# EAGLE design RH047.2 (EAGLE 7.7.0)
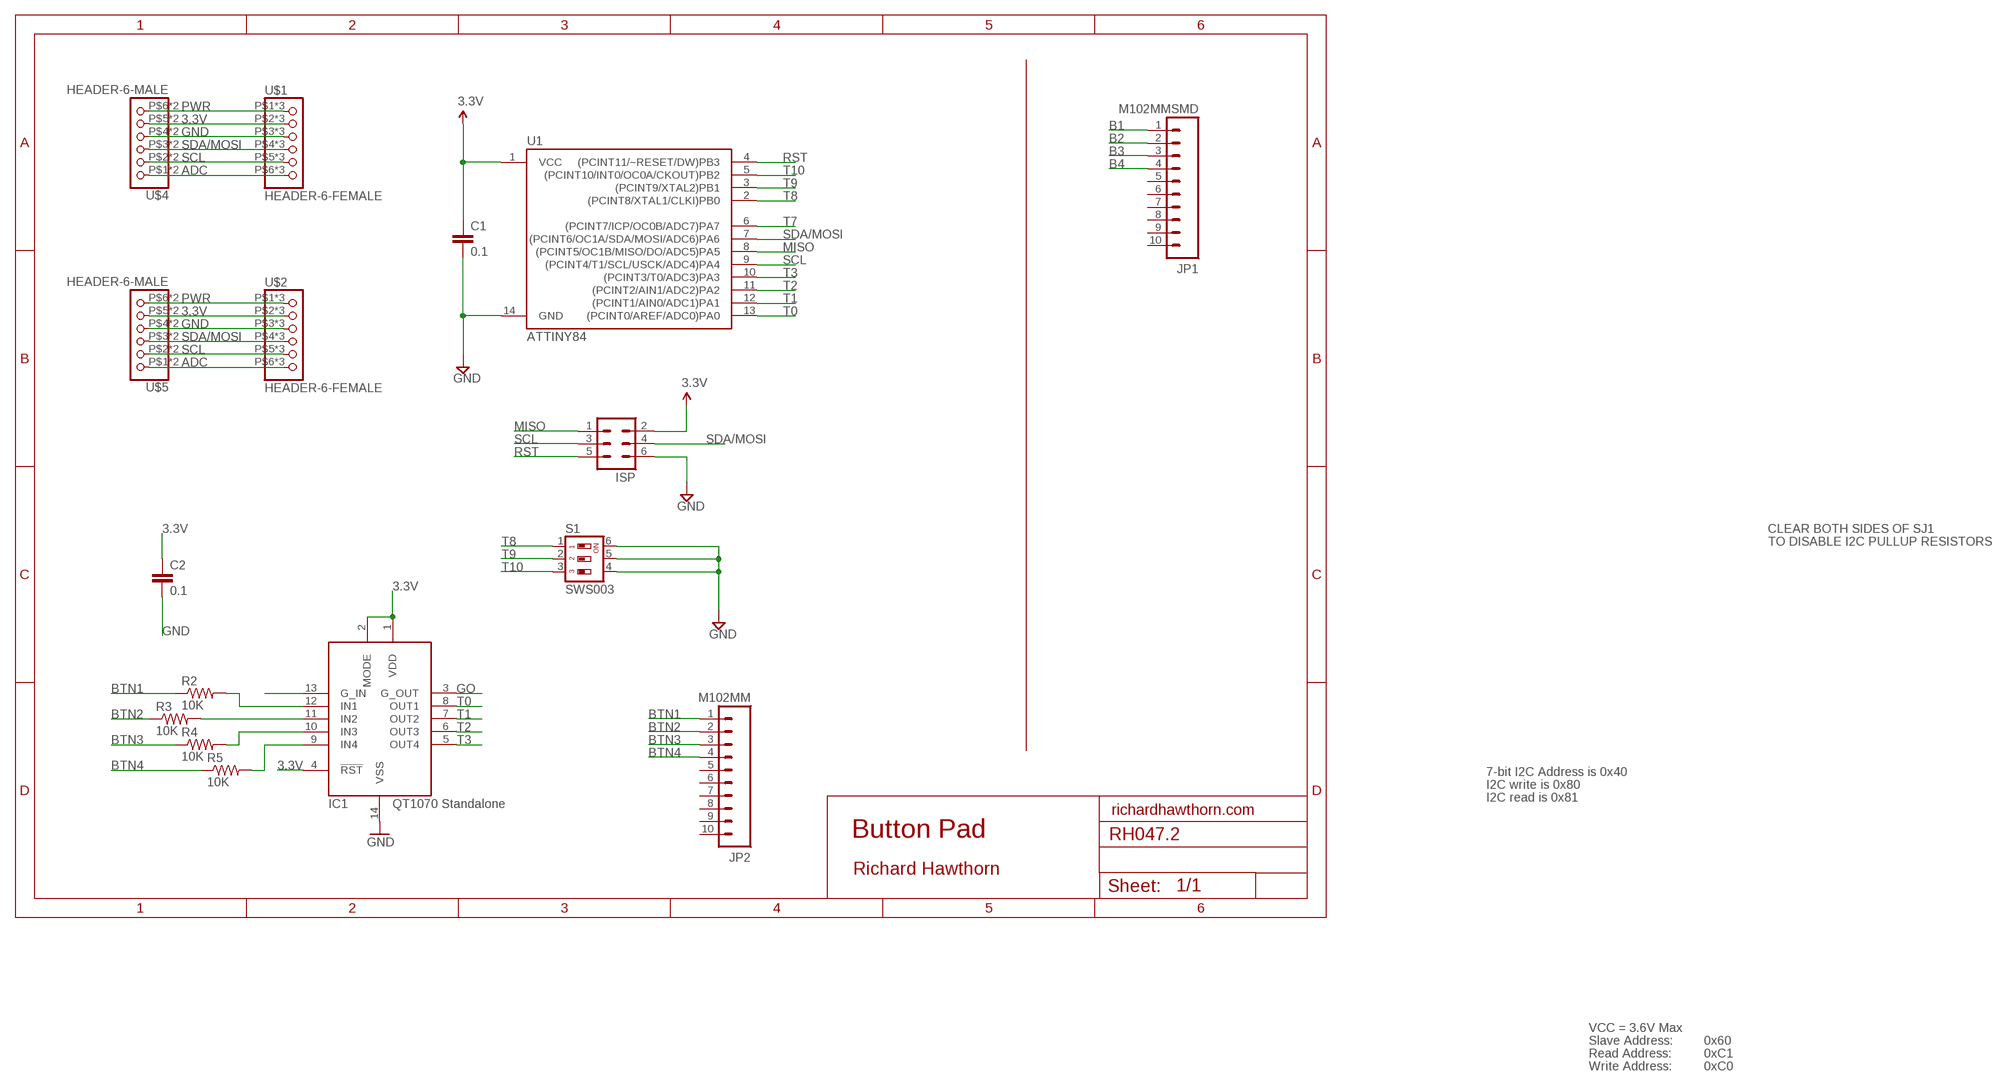
[diagram p0: schematic, sheet 1]

## Parts
C1  0.1  CAP0603-CAP  [0603-CAP]
C2  0.1  CAP0603-CAP  [0603-CAP]
IC1  AT42QT1070-SSU  [SO14]
ISP  MA03-2  [MA03-2]
JP1  M102MMSMD  [1X10-2MM-SMD]
JP2  M102MM  [1X10-2MM]
R2  10K  R-US_R0805  [R0805]
R3  10K  R-US_R0805  [R0805]
R4  10K  R-US_R0805  [R0805]
R5  10K  R-US_R0805  [R0805]
S1  SWS003  [SMS-003]
U1  ATTINY84  [SO14]
U$1  HEADER-6-FEMALE  [2MMHEADER6]
U$2  HEADER-6-FEMALE  [2MMHEADER6]
U$4  HEADER-6-MALE  [2MMHEADERPIN6]
U$5  HEADER-6-MALE  [2MMHEADERPIN6]

## Nets
3.3V: C1.1 C2.1 IC1.1(VDD) IC1.2(MODE) IC1.4(!RST) ISP.2 U1.1(VCC) U$1.P$2 U$1.P$10 U$1.P$18 U$2.P$2 U$2.P$10 U$2.P$18 U$4.P$5 U$4.P$13 U$5.P$5 U$5.P$13
ADC: U$1.P$6 U$1.P$14 U$1.P$22 U$2.P$6 U$2.P$14 U$2.P$22 U$4.P$1 U$4.P$9 U$5.P$1 U$5.P$9
B1: JP1.1
B2: JP1.2
B3: JP1.3
B4: JP1.4
BTN1: JP2.1 R2.1
BTN2: JP2.2 R3.1
BTN3: JP2.3 R4.1
BTN4: JP2.4 R5.1
GND [power]: C1.2 C2.2 IC1.14(VSS) ISP.6 S1.4 S1.5 S1.6 U1.14(GND) U$1.P$3 U$1.P$11 U$1.P$19 U$2.P$3 U$2.P$11 U$2.P$19 U$4.P$4 U$4.P$12 U$5.P$4 U$5.P$12
GO: IC1.3(G_OUT)
MISO: ISP.1 U1.8((PCINT5/OC1B/MISO/DO/ADC5)PA5)
N$1: IC1.13(G_IN)
N$2: IC1.12(IN1) R2.2
N$3: IC1.11(IN2) R3.2
N$4: IC1.10(IN3) R4.2
N$9: IC1.9(IN4) R5.2
PWR [power]: U$1.P$1 U$1.P$9 U$1.P$17 U$2.P$1 U$2.P$9 U$2.P$17 U$4.P$6 U$4.P$14 U$5.P$6 U$5.P$14
RST: ISP.5 U1.4((PCINT11/~RESET/DW)PB3)
SCL: ISP.3 U1.9((PCINT4/T1/SCL/USCK/ADC4)PA4) U$1.P$5 U$1.P$13 U$1.P$21 U$2.P$5 U$2.P$13 U$2.P$21 U$4.P$2 U$4.P$10 U$5.P$2 U$5.P$10
SDA/MOSI: ISP.4 U1.7((PCINT6/OC1A/SDA/MOSI/ADC6)PA6) U$1.P$4 U$1.P$12 U$1.P$20 U$2.P$4 U$2.P$12 U$2.P$20 U$4.P$3 U$4.P$11 U$5.P$3 U$5.P$11
T0: IC1.8(OUT1) U1.13((PCINT0/AREF/ADC0)PA0)
T1: IC1.7(OUT2) U1.12((PCINT1/AIN0/ADC1)PA1)
T2: IC1.6(OUT3) U1.11((PCINT2/AIN1/ADC2)PA2)
T3: IC1.5(OUT4) U1.10((PCINT3/T0/ADC3)PA3)
T7: U1.6((PCINT7/ICP/OC0B/ADC7)PA7)
T8: S1.1 U1.2((PCINT8/XTAL1/CLKI)PB0)
T9: S1.2 U1.3((PCINT9/XTAL2)PB1)
T10: S1.3 U1.5((PCINT10/INT0/OC0A/CKOUT)PB2)
Unconnected: JP1.5 JP1.6 JP1.7 JP1.8 JP1.9 JP1.10 JP2.5 JP2.6 JP2.7 JP2.8 JP2.9 JP2.10

## Notes on the sheet
- CLEAR BOTH SIDES OF SJ1
- TO DISABLE I2C PULLUP RESISTORS
- 7-bit I2C Address is 0x40
- I2C write is 0x80
- I2C read is 0x81
- richardhawthorn.com
- Button Pad
- Richard Hawthorn
- VCC = 3.6V Max
- Slave Address: | 0x60
- Read Address: | 0xC1
- Write Address: | 0xC0

## Library data of the parts
C1 C2 = LowPowerLab:CAP: Capacitor Standard 0603 ceramic capacitor, and 0.1" leaded capacitor.
IC1 = adafruit:AT42QT1070: QTouch 5-channel standalone sensor IC AT42QT1070 in standalone mode has 5 inputs (guard + 4 key) and open drain outputs. 1.8V-5.5V power.
ISP = Richards:MA03-2: PIN HEADER; OC_FARNELL: unknown; OC_NEWARK: unknown
JP1 JP2 = SparkFun-Connectors:M10: Header 10 Standard 10-pin 0.1" header. Use with straight break away headers (SKU : PRT-00116), right angle break away headers (PRT-00553), swiss pins (PRT-00743), machine pins (PRT-00117), and female headers (PRT-00115).
R2-R5 = rcl:R-US_: RESISTOR, American symbol
S1 = smd-special:SWS003: SMD Dip Switch 3 pol.
U1 = SparkFun-DigitalIC:ATTINY84: Atmel 14-pin 2/4/8kB flash uC
U$1 U$2 = Richards:HEADER-6-FEMALE
U$4 U$5 = Richards:HEADER-6-MALE

## Net classes
1 power: width 0.381 mm, clearance 0.254 mm

## Board
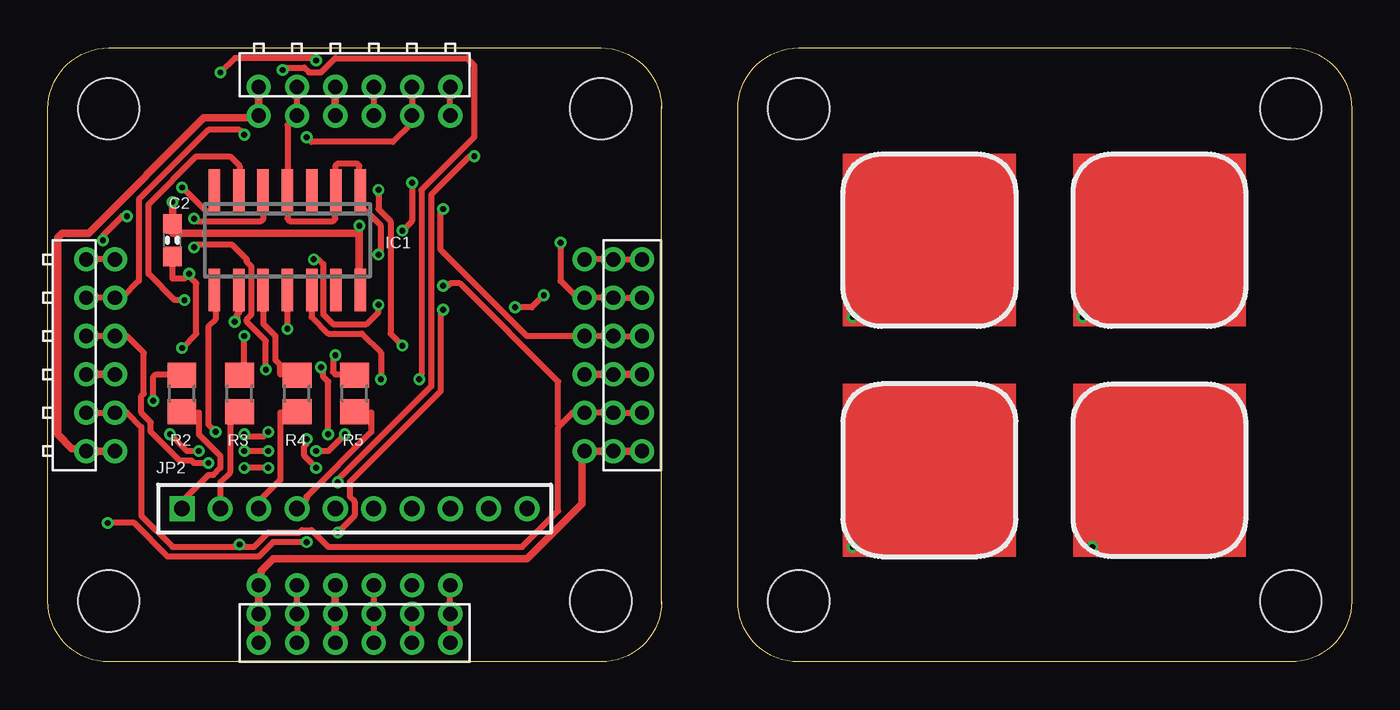
[diagram p1: board, top side]
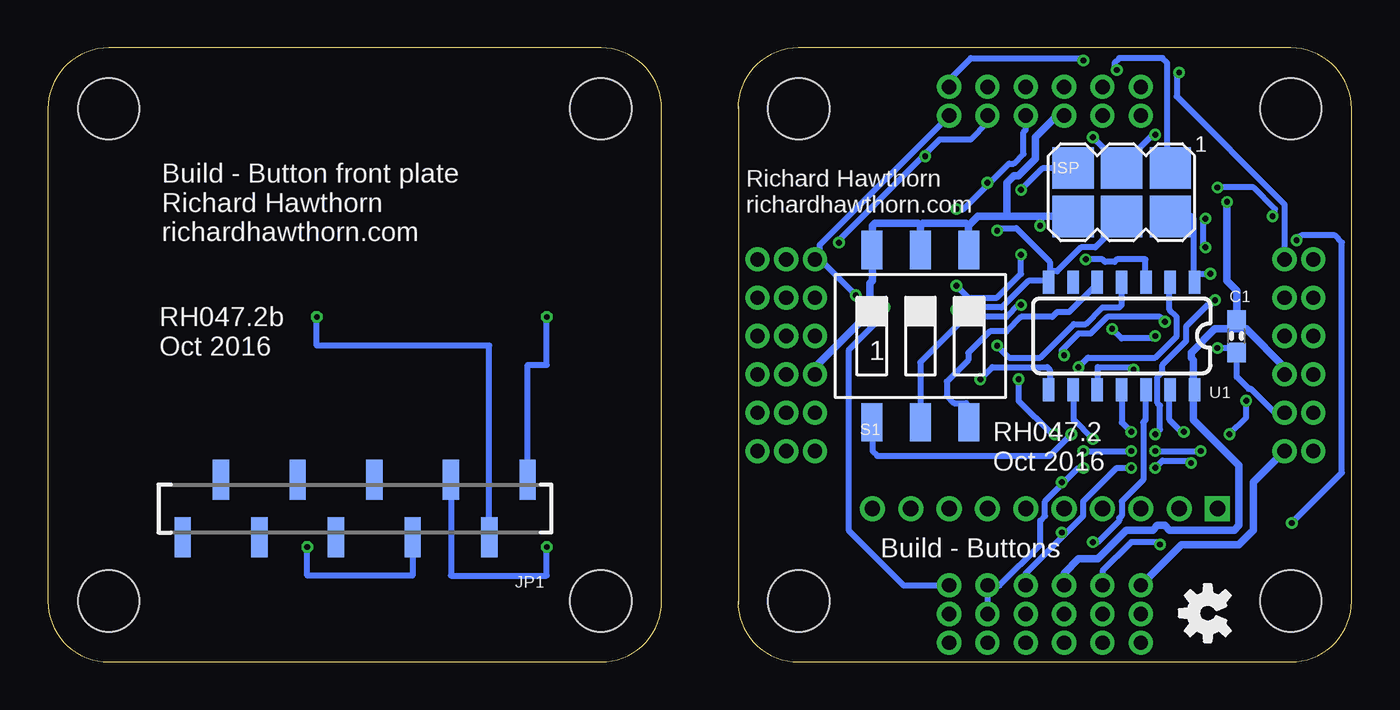
[diagram p2: board, bottom side, seen from below]

Size 68.03 x 32.03 mm. Coordinates in mm from the lower left corner, seen from the top.
Outline: 32.03,28.86 arc90 28.86,32.03 3.17,32.03 arc90 0,28.86 0,3.17 arc90 3.17,0 28.86,0 arc90 32.03,3.17
Outline: 32,25 32,9
Outline: 32,29 32,3
Outline: 36,28.86 arc-90 39.17,32.03 64.86,32.03 arc-90 68.03,28.86 68.03,3.17 arc-90 64.86,0 39.17,0 arc-90 36,3.17 36,28.86
Copper layers (1*16): Top 0.035mm / dielectric 1.5mm / Bottom 0.035mm
Design rules "ITEADstudio_DRC *": minimum track width 12mil, minimum drill 12mil, track to track 6mil, track to pad 6mil, pad to pad 6mil, via to via 6mil, smd to smd 0mil, copper to edge 10mil, drill to drill 10mil, minimum pad ring 10mil, minimum via ring 6mil, stop-mask expansion 2mil, vias tented up to drill 100mil, thermal gap 15mil
Holes 3.2 mm at 3.17,3.17 28.86,3.17 3.17,28.86 28.86,28.86 64.86,28.86 39.17,28.86 39.17,3.17 64.86,3.17
tRestrict: area 0,0 to 5.7,5.7; area 26.3,0 to 32,5.7; area 26.3,26.3 to 32,32; area 0,26.3 to 5.7,32
bRestrict: area 0,26.3 to 5.7,32; area 26.3,26.3 to 32,32; area 26.3,0 to 32,5.7; area 0,0 to 5.7,5.7

### Footprints (pad centres in the part's own frame; a part is rotated, then mirrored left to right if it is on the bottom)
0603-CAP = smd 1.016 x 0.965: 1 -0.85,0; 2 0.85,0
SO14 = smd 0.6 x 2.2: 1 -3.81,-2.6; 2 -2.54,-2.6; 3 -1.27,-2.6; 4 0,-2.6; 5 1.27,-2.6; 6 2.54,-2.6; 7 3.81,-2.6; 8 3.81,2.6; 9 2.54,2.6; 10 1.27,2.6; 11 0,2.6; 12 -1.27,2.6; 13 -2.54,2.6; 14 -3.81,2.6
MA03-2 = smd 2.159 x 2.159: 1 -2.54,-1.27; 2 -2.54,1.27; 3 0,-1.27; 4 0,1.27; 5 2.54,-1.27; 6 2.54,1.27
1X10-2MM-SMD = smd 0.85 x 2.1: 1 0,-1.5; 2 2,1.5; 3 4,-1.5; 4 6,1.5; 5 8,-1.5; 6 10,1.5; 7 12,-1.5; 8 14,1.5; 9 16,-1.5; 10 18,1.5
1X10-2MM = drill 0.8 square: 1 0,0 | drill 0.8: 2 2,0; 3 4,0; 4 6,0; 5 8,0; 6 10,0; 7 12,0; 8 14,0; 9 16,0; 10 18,0
R0805 = smd 1.3 x 1.5: 1 -0.95,0; 2 0.95,0
SMS-003 = smd 1.092 x 2.007: 1 -2.54,-4.496; 2 0,-4.496; 3 2.54,-4.496; 4 2.54,4.496; 5 0,4.496; 6 -2.54,4.496
SO14' = smd 0.6 x 1.2: 1 -3.81,-2.8; 2 -2.54,-2.8; 3 -1.27,-2.8; 4 0,-2.8; 5 1.27,-2.8; 6 2.54,-2.8; 7 3.81,-2.8; 8 3.81,2.8; 9 2.54,2.8; 10 1.27,2.8; 11 0,2.8; 12 -1.27,2.8; 13 -2.54,2.8; 14 -3.81,2.8
2MMHEADER6 = drill 0.75: P$1 1,5; P$2 1,3; P$3 1,1; P$4 1,-1; P$5 1,-3; P$6 1,-5; P$9 -0.5,5; P$10 -0.5,3; P$11 -0.5,1; P$12 -0.5,-1; P$13 -0.5,-3; P$14 -0.5,-5; P$17 -2,5; P$18 -2,3; P$19 -2,1; P$20 -2,-1; P$21 -2,-3; P$22 -2,-5
2MMHEADERPIN6 = drill 0.75: P$1 1,5; P$2 1,3; P$3 1,1; P$4 1,-1; P$5 1,-3; P$6 1,-5; P$9 -0.5,5; P$10 -0.5,3; P$11 -0.5,1; P$12 -0.5,-1; P$13 -0.5,-3; P$14 -0.5,-5

### Placement (x,y rotation side)
C1  6,17 90 bottom
C2  6.5,22 90 top
IC1  12.5,22 180 top
ISP  12,24.5 180 bottom
JP1  43,8 180 bottom
JP2  7,8 0 top
R2  7,14 90 top
R3  10,14 90 top
R4  13,14 90 top
R5  16,14 90 top
S1  22.5,17 0 bottom
U1  ATTINY84  [SO14']  12,17 180 bottom
U$1  16,3 90 top
U$2  29,16 180 top
U$3  [OSHW-LOGO-S]  7.5,2.55 90 bottom
U$4  16,29.5 270 top
U$5  2.5,16 0 top

### Tracks (layer width: path | path; a pad name or v marks a point on that pad's centre or on a via)
3.3V  (via drill 0.3)
  Top 0.305: U$4.P$13 U$4.P$5 12.5,28 IC1.4 12.5,23.12 12.62,23 14.88,23 15,23.12 15,24.5 IC1.2 15,24.62 15,25.88 15.12,26 16.12,26 16.25,25.88 16.25,24.62 IC1.1 16.25,24.5 16.25,23.62 16.38,23.5 16.62,23.5 17.38,22.75 17.38,21.38 v17.25,21.25 | C2.1 6.5,20 7.12,20 v7.38,20.25 7.38,20.12 7.75,19.75 7.75,17.12 v7,16.38 | U$2.P$18 U$2.P$10 U$2.P$2 27.38,13 26.69,12.31 | U$1.P$18 U$1.P$10 U$1.P$2 | U$5.P$13 U$5.P$5 4.12,13 4.88,12.25 4.88,7.62 6.5,6 9.88,6 v10,6.12 10,6 10.75,6 11.5,6.75 13.12,6.75 13.25,6.88 13.75,6.88 14.62,6 24.75,6 26.62,7.88 26.62,12.25 26.69,12.31 | v20.62,19.62 20.88,19.62 21,19.75 21.5,19.75 26.62,14.62 26.62,12.38 26.69,12.31
  Bottom 0.305: v7.38,20.25 8.25,20.25 8.25,19.88 U1.1 8.25,20.38 8.25,23.12 8.38,23.25 9.38,23.25 ISP.2 | U$5.P$5 4,13 5.25,14.25 5.38,14.25 6,14.88 C1.1 6,16.38 v7,16.38 | U$1.P$2 13,4.75 11.5,6.25 10.12,6.25 v10,6.12 | v17.25,21.25 17.25,20.25 18.5,19 20,19 v20.62,19.62
ADC  (via drill 0.3)
  Top 0.305: U$5.P$1 U$5.P$9 | U$4.P$1 U$4.P$9 | v9,30.75 9.75,31.5 13.88,31.5 v14,31.38 | U$1.P$22 U$1.P$14 U$1.P$6 | U$2.P$6 U$2.P$14 U$2.P$22 | v24.38,18.5 25.25,18.5 v25.88,19.12
  Bottom 0.305: U$5.P$1 3.5,23.88 9.12,29.5 9.12,30.62 v9,30.75 | v14,31.38 14.12,31.5 19.88,31.5 21,30.38 U$4.P$9 | U$1.P$6 23.38,4 26.25,6.88 26.25,16.25 24.5,18 24.5,18.38 v24.38,18.5 | v25.88,19.12 27.75,21 U$2.P$6 27.75,21.12 27.75,21.75 U$4.P$1
B1  (via drill 0.3)
  Top 0.305: v42,18 42,19
  Bottom 0.305: JP1.1 43,15.5 42,15.5 v42,18
B2  (via drill 0.3)
  Bottom 0.305: JP1.2 45,16.5 54,16.5 v54,18
B3  (via drill 0.3)
  Bottom 0.305: JP1.3 47,4.5 42,4.5 v42,6
B4  (via drill 0.3)
  Bottom 0.305: JP1.4 49,4.5 54.5,4.5 v54.5,6
BTN1
  Top 0.305: JP2.1 7,8.38 8.38,9.75 8.62,9.75 9,10.12 9,10.75 7.88,11.88 7.88,13 7,13 R2.1
BTN2
  Top 0.305: JP2.2 9,9.38 9.5,9.88 9.5,13 10,13 R3.1
BTN3
  Top 0.305: JP2.3 11,8.38 12.12,9.5 12.12,13 13,13 R4.1
BTN4
  Top 0.305: JP2.4 13.5,8.5 13.5,8.62 16.88,12 16.88,13 16,13 R5.1
GND  (via drill 0.3)
  Top 0.381: U$2.P$3 U$2.P$11 U$2.P$19 | U$4.P$12 U$4.P$4 | v16.25,22.75 16.25,22.38 | 16.25,22.38 16.25,19.5 IC1.14 | U$1.P$19 U$1.P$11 U$1.P$3 | U$5.P$12 U$5.P$4 | v6.5,24 C2.2 6.5,22.38 16.25,22.38
  Bottom 0.381: 20,22.75 20,21.5 S1.4 | 20,22.75 20.12,22.88 22.38,22.88 22.5,22.75 | S1.5 22.5,22.75 | 22.5,22.75 22.62,22.88 24.88,22.88 25,22.75 25,21.5 S1.6 25,21.38 25,19.88 25.12,19.75 25.12,18.25 28,15.38 U$2.P$3 | 18,23.25 19.5,23.25 20,22.75 | 18,23.25 16.25,23.25 | 16.25,23.25 14.62,23.25 ISP.6 | 16.25,23.25 v16.25,22.75 | U$4.P$4 15.38,28.5 16.5,27.38 16.5,26.25 17.38,25.38 17.62,25.38 18,25 18,23.25 | C1.2 6,17.38 7.12,17.38 8.38,16.12 8.38,15.88 8.25,15.75 8.25,14.25 U1.14 8.25,14.12 8.25,12.62 5.88,10.25 5.88,7.12 6.12,6.88 9.5,6.88 9.75,7.12 10.12,7.12 10.38,6.88 11.75,6.88 13.25,5.38 14.25,5.38 15,4.62 U$1.P$3 | v6.5,24 6.5,19.88 6,19.38 C1.2 | U$5.P$4 3.5,15.38 5.5,17.38 5.88,17.38 C1.2
MISO  (via drill 0.3)
  Top 0.305: v19.38,14.75 19.38,14.88 19.5,15 19.5,24.62 22.25,27.38 22.25,31.12 21.88,31.5 15,31.5 14.25,30.75 13.62,30.75 13.38,31 12.38,31 v12.25,30.88
  Bottom 0.305: v19.38,14.75 18.75,15.38 15.88,15.38 15.75,15.25 15.75,14.25 U1.8 | v12.25,30.88 12.38,31 12.38,31.25 12.12,31.5 9.88,31.5 9.62,31.25 9.62,25.75 9.5,25.75 ISP.1
N$2  (via drill 0.3)
  Top 0.305: v5.5,13.62 5.5,14.88 5.62,15 7,15 R2.2 | v6.38,11.88 7.25,11 v7.88,11 | v11.5,11 v10.25,11 | v14,11 14.62,11 v15.5,11.88 | v17.38,14.75 17.38,16.12 16.38,17.12 14.62,17.12 13.75,18 13.75,19.38 IC1.12
  Bottom 0.305: v5.5,13.62 5.5,12.75 v6.38,11.88 | v10.25,11 v7.88,11 | v14,11 v11.5,11 | v15.5,11.88 15.62,11.88 17.38,13.62 v17.38,14.75
N$3  (via drill 0.3)
  Top 0.305: v12.5,17.38 IC1.11 | v10.25,17 10.25,15 10,15 R3.2
  Bottom 0.305: v12.5,17.38 12,16.88 10.38,16.88 v10.25,17
N$4
  Top 0.305: IC1.10 11.25,19.38 11.25,17.62 11.88,17 11.88,15.75 12.12,15.5 12.12,15 13,15 R4.2
N$9  (via drill 0.3)
  Top 0.305: v15,16 14.88,15.88 14.88,15.12 15,15 16,15 R5.2 | v9.75,17.75 9.88,17.88 9.88,18.12 10,18.25 10,19.38 IC1.9
  Bottom 0.305: v15,16 15.12,16.12 15.12,16.25 14.25,17.12 13.62,17.12 12.75,18 10,18 v9.75,17.75
PWR
  Top 0.381: U$2.P$17 U$2.P$9 U$2.P$1 27.88,10.88 27.88,8.25 25,5.38 11.75,5.38 11.12,4.75 11.12,4.12 U$1.P$1 U$1.P$9 U$1.P$17 | U$4.P$14 U$4.P$6 10.88,28.38 8.12,28.38 2.12,22.38 0.75,22.38 0.5,22.12 0.5,11.88 1.25,11.12 1.88,11.12 U$5.P$14 U$5.P$6
  Bottom 0.381: U$5.P$6 5.12,9.38 5.12,6.88 5.88,6.12 8.88,6.12 U$1.P$1
RST  (via drill 0.3)
  Top 0.305: v18.5,16.5 17.88,17.12 17.88,23 17.25,23.62 v17.25,24.62
  Bottom 0.305: U1.4 12,18.62 12.12,18.5 13,18.5 13.88,17.62 14.5,17.62 16.25,15.88 17.88,15.88 v18.5,16.5 | v17.25,24.62 16.12,25.75 14.62,25.75 ISP.5
SCL  (via drill 0.3)
  Top 0.305: U$1.P$13 U$1.P$21 | v13.5,11.62 13.5,11.38 13.38,11.25 13.38,10.75 v14,10.12 | U$2.P$21 U$2.P$13 U$2.P$5 27.62,19 26.75,19.88 v26.75,21.88 | U$5.P$10 U$5.P$2 3.88,19 4.75,19.88 4.75,24.12 8.38,27.75 10,27.75 v10.25,27.5 | U$4.P$10 U$4.P$2 19,28.12 18,27.12 13.75,27.12 v13.5,27.38 | v15.12,9.38 15.12,9.5 20,14.38 20,24.38 22,26.38 v22.25,26.38
  Bottom 0.305: v13.5,11.62 14.5,12.62 14.5,14.12 U1.9 | v14,10.12 14.25,10.12 15.06,9.31 | 15.06,9.31 16,8.38 16,7.62 16.25,7.38 16.25,6.12 18.38,4 U$1.P$5 U$1.P$13 | v13.5,27.38 12.88,26.75 12.88,25.75 12,25.75 ISP.3 11.88,25.75 11.12,25.75 11.12,26.75 10.38,27.5 v10.25,27.5 | v26.75,21.88 26.75,22 22.31,26.44 | 22.31,26.44 21.5,27.25 19.88,27.25 19,28.12 U$4.P$2 | v15.12,9.38 15.06,9.31 | v22.25,26.38 22.31,26.44
SDA/MOSI  (via drill 0.3)
  Top 0.305: U$5.P$11 U$5.P$3 4.12,17 5,16.12 5,14 4.88,13.88 4.88,13 5.38,12.5 5.38,12 6.88,10.5 7.5,10.5 7.62,10.38 v8.38,10.38 | U$1.P$4 U$1.P$12 U$1.P$20 | v11.5,10.12 v10.25,10.12 | U$4.P$11 U$4.P$3 | U$2.P$20 U$2.P$12 U$2.P$4 25,17 20.5,21.5 20.5,23.5 v20.62,23.62 | v18.5,22.5 19,23 v19,25 | v15.12,6.75 16,7.62 16,8.38 15.75,8.62 15.75,9.38 20.5,14.12 20.5,18.25 v20.62,18.38
  Bottom 0.305: v8.38,10.38 8.5,10.5 9.88,10.5 v10.25,10.12 | v11.5,10.12 12.25,10.12 14,8.38 14,7.62 15.06,6.56 | 15.06,6.56 17,4.62 U$1.P$4 | 15.75,20.38 15.75,19.88 U1.7 15.88,19.88 16.88,19.88 18.25,18.5 20.38,18.5 20.5,18.38 v20.62,18.38 | 15.75,20.38 15.38,20.38 14.12,21.62 13.38,21.62 12.75,22.25 12.75,23.25 12,23.25 ISP.4 | U$4.P$3 17,27.75 17.12,27.62 17.12,26.5 17.62,26 17.88,26 18.94,24.94 | 18.94,24.94 20.25,23.62 v20.62,23.62 | 15.75,20.38 15.75,20.88 17.5,22.62 18.38,22.62 v18.5,22.5 | v19,25 18.94,24.94 | v15.12,6.75 15.12,6.62 15.06,6.56
T0  (via drill 0.3)
  Top 0.305: v8.75,12 8.38,12.38 8.38,17.5 8.75,17.88 8.75,19.38 IC1.8
  Bottom 0.305: v8.75,12 8.88,12 9.5,12.62 9.5,14.12 U1.13
T1  (via drill 0.3)
  Top 0.305: v7,24.75 8.25,23.5 8.75,23.5 8.75,24.5 IC1.7 | v4.12,23.25 3.88,23.25 2.88,22.25 v2.88,22 | v3.12,7.25 4.5,7.25 6.25,5.5 11,5.5 11.75,6.25 v13.5,6.25
  Bottom 0.305: v7,24.75 5.12,24.75 4,23.62 4,23.38 v4.12,23.25 | v2.88,22 2.62,22.25 0.88,22.25 0.5,21.88 0.5,9.88 v3.12,7.25 | v13.5,6.25 13.25,6.25 12.12,7.38 12.12,7.5 12,7.62 12,8.38 10.88,9.5 10.88,12.5 10.75,12.62 10.75,14.12 U1.12
T2  (via drill 0.3)
  Top 0.305: v7.12,18.88 6.62,18.88 5.25,20.25 5.25,23.88 7.75,26.38 9.5,26.38 10,25.88 10,24.62 IC1.6 | v10.25,11.88 10.38,11.75 11.25,11.75 v11.5,12
  Bottom 0.305: v7.12,18.88 7.38,18.62 7.5,18.62 8.62,17.5 8.62,16.75 9.88,15.5 9.88,15.12 10.12,14.88 10.12,13.5 10,13.38 10,12.12 v10.25,11.88 | v11.5,12 12,12.5 U1.11
T3  (via drill 0.3)
  Top 0.305: v7.62,23.12 7.75,23 11.12,23 11.25,23.12 11.25,24.5 IC1.5 | v7.62,21.62 7.75,21.75 9.62,21.75 10.38,21 10.38,20.88 10.62,20.62 10.62,18.12 10.38,17.88 10.38,17.75 11.38,16.75 v11.38,15.25
  Bottom 0.305: v7.62,23.12 7.75,23 7.75,21.75 v7.62,21.62 | v11.38,15.25 11.5,15.38 13.25,15.38 13.25,14.25 U1.10
T8  (via drill 0.3)
  Top 0.305: v14.25,15.38 14.38,15.25 14.38,14.88 14.62,14.62 v14.62,11.88
  Bottom 0.305: v14.25,15.38 13.75,15.88 10.25,15.88 9.12,17 9.12,18 9.5,18.38 9.5,19.75 U1.2 | v14.62,11.88 15.75,10.75 24.75,10.75 25,11 25,12.5 S1.1
T9  (via drill 0.3)
  Top 0.305: v17.25,18.62 17.25,18.25 16.62,17.62 14.88,17.62 14.38,18.12 14.38,20.75 14.12,21 v13.88,21
  Bottom 0.305: S1.2 22.5,15.62 20.12,18 18,18 17.38,18.62 v17.25,18.62 | v13.88,21 13,21 12.88,20.88 12.38,20.88 12.25,21 10.75,21 10.75,19.88 U1.3
T10
  Bottom 0.305: S1.3 20,12.62 20,13.38 20.12,13.5 20.75,13.5 21.12,13.88 21.12,14.62 20,15.75 20,16.12 18.88,17.25 18,17.25 17.25,18 15.62,18 15.38,18.25 14.75,18.25 13.38,19.62 13.25,19.62 13.25,19.75 U1.5
(copper drawn outside any net)
  shapes: Top area x4

### Text on the board
bPlace: Richard Hawthorn / richardhawthorn.com | Build - Button front plate / Richard Hawthorn / richardhawthorn.com | RH047.2b / Oct 2016 | RH047.2 / Oct 2016 | Build - Buttons
tDocu: REG